# EAGLE design holo clock 1 l293 rotate 90 (EAGLE 6.2)
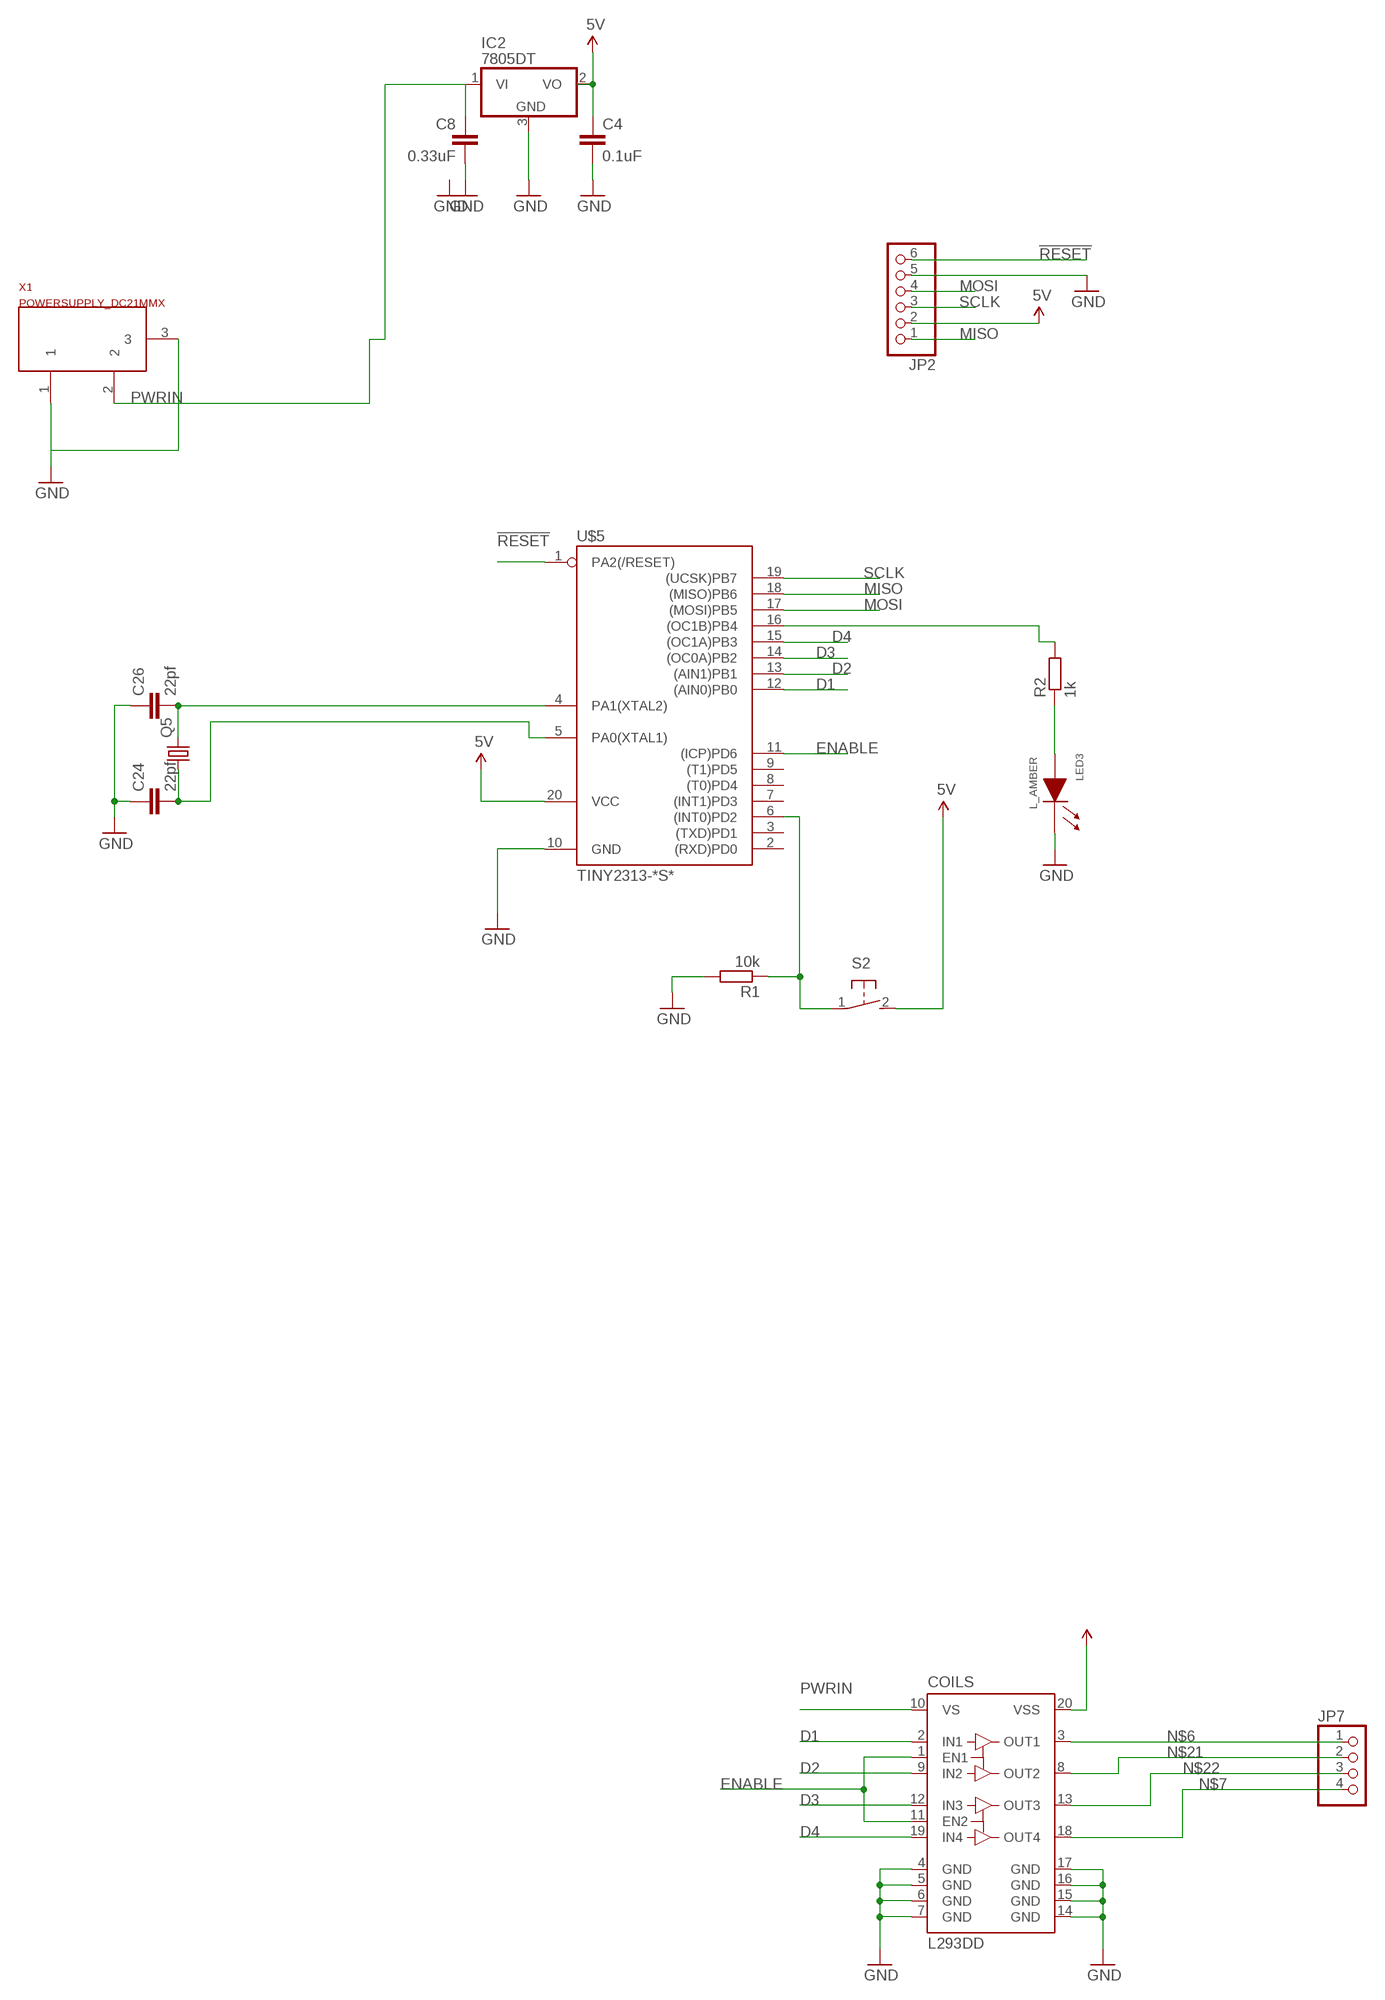
[diagram p0: schematic, sheet 1]

## Parts
C4  0.1uF  CAPPTH2  [CAP-PTH-SMALL2]
C8  0.33uF  CAPPTH2  [CAP-PTH-SMALL2]
C24  22pf  CAP0805  [0805]
C26  22pf  CAP0805  [0805]
COILS  L293DD  [SO20]
IC2  7805DT  [TO252]
JP2  PINHD-1X6  [1X06]
JP7  PINHD-1X04_2.54  [1X04]
LED3  L_AMBER  LED0805  [LED0805]
Q5  CRYSTALHC49S  [HC49/S]
R1  10k  R-EU_R0805  [R0805]
R2  1k  R-EU_R0805  [R0805]
S2  31-XX  [B3F-31XX]
U$5  TINY2313-*S*  [SO20L$]
X1  POWERSUPPLY_DC21MMX  [POWERSUPPLY_DC-21MM]

## Nets
5V: C4.1 COILS.20(VSS) IC2.2(VO) JP2.2 S2.2(S) U$5.20(VCC)
!RESET: JP2.6 U$5.1(PA2(/RESET))
D1: COILS.2(IN1) U$5.12((AIN0)PB0)
D2: COILS.9(IN2) U$5.13((AIN1)PB1)
D3: COILS.12(IN3) U$5.14((OC0A)PB2)
D4: COILS.19(IN4) U$5.15((OC1A)PB3)
ENABLE: COILS.1(EN1) COILS.11(EN2) U$5.11((ICP)PD6)
GND: C4.2 C8.2 C24.1 C26.1 COILS.4(GND) COILS.5(GND) COILS.6(GND) COILS.7(GND) COILS.14(GND) COILS.15(GND) COILS.16(GND) COILS.17(GND) IC2.3(GND) JP2.5 LED3.1(CA) R1.2 U$5.10(GND) X1.1 X1.3
MISO: JP2.1 U$5.18((MISO)PB6)
MOSI: JP2.4 U$5.17((MOSI)PB5)
N$2: R2.2 U$5.16((OC1B)PB4)
N$6 [power 2]: COILS.3(OUT1) JP7.1
N$7 [power 2]: COILS.18(OUT4) JP7.4 LED3.2(AN) R2.1
N$8: R1.1 S2.1(P) U$5.6((INT0)PD2)
N$21 [power 2]: COILS.8(OUT2) JP7.2
N$22 [power 2]: COILS.13(OUT3) JP7.3
N$80: C26.2 Q5.2 U$5.4(PA1(XTAL2))
N$81: C24.2 Q5.1 U$5.5(PA0(XTAL1))
PWRIN [power]: C8.1 COILS.10(VS) IC2.1(VI) X1.2
SCLK: JP2.3 U$5.19((UCSK)PB7)
Unconnected: U$5.2((RXD)PD0) U$5.3((TXD)PD1) U$5.7((INT1)PD3) U$5.8((T0)PD4) U$5.9((T1)PD5)

## Library data of the parts
C4 C8 C24 C26 = SparkFun:CAP: Capacitor Standard 0603 ceramic capacitor, and 0.1" leaded capacitor.
COILS = st-microelectronics:L293DD: PUSH-PULL FOUR CHANNEL DRIVER WITH DIODES Source: http://www.st.com/stonline/books/pdf/docs/1330.pdf; OC_FARNELL: unknown
IC2 = linear:78*: Positive VOLTAGE REGULATOR Source: http://cache.national.com/ds/LM/LM78L05.pdf http://www.fairchildsemi.com/ds/LM/LM7805.pdf
JP2 = pinhead:PINHD-1X6: PIN HEADER
JP7 = pinhead-2:PINHD-1X04: PIN HEADER
LED3 = MySMD:LED0805
Q5 = crystal:CRYSTAL: CRYSTAL; OC_FARNELL: 1667008; OC_NEWARK: unknown
R1 R2 = resistor:R-EU_: RESISTOR, European symbol
S2 = switch-omron:31-XX: OMRON SWITCH; MPN: B3F-3100; OC_FARNELL: 959704; OC_NEWARK: 36M3582
U$5 = avr-7:TINY2313*: Atmel Tiny2313 2K Flash, 128 bytes EEPROM, 128 bytes RAM
X1 = SmartPrj:POWERSUPPLY_DC21MM

## Net classes
1 power: width 1.27 mm, drill 1.016 mm
2 power 2: width 1.016 mm, drill 0.762 mm

## Board
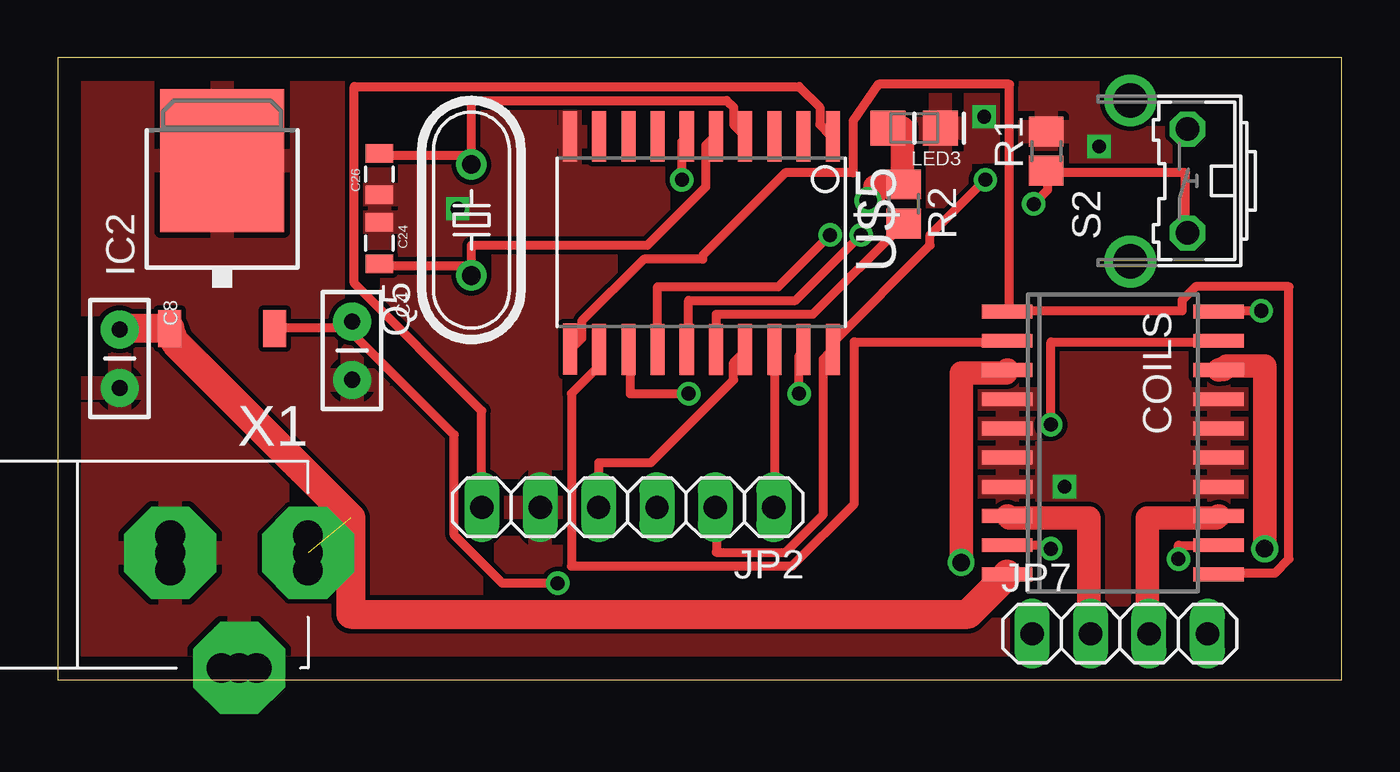
[diagram p1: board, top side]
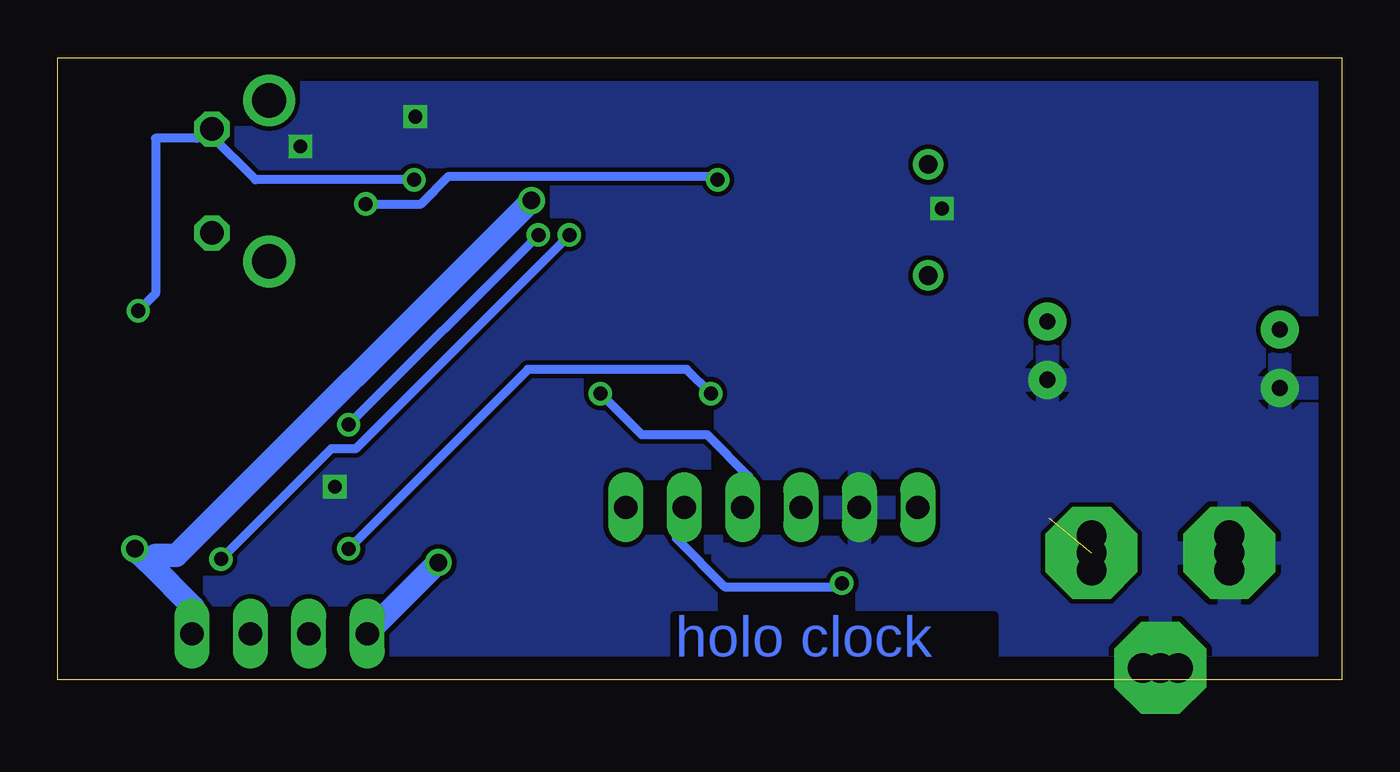
[diagram p2: board, bottom side, seen from below]

Size 55.86 x 27.07 mm. Coordinates in mm from the lower left corner, seen from the top.
Outline: 0,0 55.86,0 55.86,27.07 0,27.07 0,0
Copper layers (1*16): Top 0.035mm / dielectric 1.5mm / Bottom 0.035mm
Design rules: minimum track width 15mil, minimum drill 24mil, track to track 8mil, track to pad 8mil, pad to pad 8mil, via to via 8mil, smd to smd 8mil, copper to edge 40mil, drill to drill 8mil, minimum pad ring 10mil, minimum via ring 8mil, stop-mask expansion 4mil, vias tented up to drill 0mil, thermal gap 10mil

### Footprints (pad centres in the part's own frame; a part is rotated, then mirrored left to right if it is on the bottom)
CAP-PTH-SMALL2 = drill 0.7 pad 1.651: 1 0,0; 2 2.54,0
0805 = smd 0.8 x 1.2: 1 -0.9,0; 2 0.9,0
SO20 = smd 0.6 x 2.2: 1 -5.715,-4.6; 2 -4.445,-4.6; 3 -3.175,-4.6; 4 -1.905,-4.6; 5 -0.635,-4.6; 6 0.635,-4.6; 7 1.905,-4.6; 8 3.175,-4.6; 9 4.445,-4.6; 10 5.715,-4.6; 11 5.715,4.6; 12 4.445,4.6; 13 3.175,4.6; 14 1.905,4.6; 15 0.635,4.6; 16 -0.635,4.6; 17 -1.905,4.6; 18 -3.175,4.6; 19 -4.445,4.6; 20 -5.715,4.6
TO252 = smd 1 x 1.6: 1 -2.28,-4.8; 2 2.28,-4.8 | smd 5.4 x 6.2: 3 0,2.5
1X06 = drill 1.016 long: 1 -6.35,0; 2 -3.81,0; 3 -1.27,0; 4 1.27,0; 5 3.81,0; 6 6.35,0
1X04 = drill 1.016 long: 1 -3.81,0; 2 -1.27,0; 3 1.27,0; 4 3.81,0
LED0805 = smd 1.524 x 1.524: 1 0,0; 2 2.286,0
HC49/S = drill 0.813: 1 -2.413,0; 2 2.413,0
R0805 = smd 1.3 x 1.5: 1 -0.85,0; 2 0.85,0
B3F-31XX = drill 1.016 octagon: 1 -2.261,-1.245; 2 2.261,-1.245 | drill 1.499 pad 2.159: 3 -3.505,1.245; 4 3.505,1.245
SO20L$ = smd 0.61 x 2.21: 1 -5.715,-4.636; 2 -4.445,-4.636; 3 -3.175,-4.636; 4 -1.905,-4.636; 5 -0.635,-4.636; 6 0.635,-4.636; 7 1.905,-4.636; 8 3.175,-4.636; 9 4.445,-4.636; 10 5.715,-4.636; 11 5.715,4.61; 12 4.445,4.636; 13 3.175,4.636; 14 1.905,4.636; 15 0.635,4.636; 16 -0.635,4.636; 17 -1.905,4.636; 18 -3.175,4.636; 19 -4.445,4.636; 20 -5.715,4.636
POWERSUPPLY_DC-21MM = drill 1.3 pad 4 octagon: 1 -5.08,-3.353; 2 -0.076,-6.35; 3 -0.076,-0.356 | drill 1.3: 4 -5.08,-4.115; 5 -5.08,-2.591; 6 -0.838,-0.356; 7 0.686,-0.356; 8 -0.838,-6.35; 9 0.686,-6.35

### Placement (x,y rotation side)
C4  12.81,15.59 270 top
C8  2.7,15.24 270 top
C24  14,19 270 top
C26  14,22 90 top
COILS  45.9,10.3 270 top
IC2  7.16,20.08 0 top
JP2  24.8,7.5 180 top
JP7  46.2,2 0 top
LED3  38.4,24 180 top
Q5  18,20 90 top
R1  43,23 90 top
R2  36.8,20.7 270 top
S2  47.9,21.7 90 top
U$5  28,19 180 top
X1  4.54,5.59 90 top

### Tracks (layer width: path | path; a pad name or v marks a point on that pad's centre or on a via)
5V  (via drill 0.61)
  Top 0.381: v52.35,16.05 50.55,16.05 COILS.20 | IC2.2 9.45,15.3 12.75,15.3 12.75,15.45 C4.1 12.75,15.15 17.25,10.65 17.25,6.3 19.35,4.2 v21.75,4.2 | JP2.2 28.65,7.5 28.65,5.55 31.65,5.55 33.3,7.2 33.3,13.95 33.6,14.25 U$5.20 33.75,14.55 33.75,14.7 37.95,18.9 37.95,19.35 v40.35,21.75
  Bottom 0.381: v52.35,16.05 51.6,16.8 51.6,23.55 49.8,23.55 49.5,23.85 49.2,23.85 S2.2 49.2,23.7 47.25,21.75 v40.35,21.75 | v21.75,4.2 21.9,4.05 26.85,4.05 28.95,6.15 28.95,7.5 JP2.2
!RESET
  Top 0.381: JP2.6 18.45,11.7 12.9,17.25 12.9,25.8 32.25,25.8 33.15,24.9 33.15,24.15 33.6,23.7 U$5.1
D1
  Top 0.381: COILS.2 41.25,14.7 34.65,14.7 34.65,7.65 31.95,4.95 22.35,4.95 22.35,12.45 23.55,13.65 23.55,14.25 U$5.12
D2  (via drill 0.61)
  Top 0.381: v43.2,5.7 43.2,5.85 41.4,5.85 COILS.9 | v27.45,12.45 24.9,12.45 24.9,14.25 U$5.13
  Bottom 0.381: v43.2,5.7 35.4,13.5 28.5,13.5 v27.45,12.45
D3  (via drill 0.61)
  Top 0.381: v48.75,5.25 48.75,5.85 50.4,5.85 COILS.12 | v33.6,19.35 31.35,17.1 26.1,17.1 26.1,14.4 U$5.14
  Bottom 0.381: v48.75,5.25 43.95,10.05 42.9,10.05 v33.6,19.35
D4  (via drill 0.61)
  Top 0.381: v43.2,11.1 43.2,14.7 50.4,14.7 COILS.19 | v34.95,19.35 32.1,16.5 27.45,16.5 27.45,14.4 U$5.15
  Bottom 0.381: v34.95,19.35 v43.2,11.1
ENABLE
  Top 0.381: COILS.11 50.55,4.65 52.95,4.65 53.55,5.25 53.55,17.1 49.5,17.1 48.9,16.5 48.9,16.05 41.4,16.05 COILS.1 41.4,16.2 41.4,25.9 35.7,25.9 34.6,24.3 34.6,22.05 31.65,22.05 28.05,18.45 28.05,18.3 25.5,18.3 22.8,15.6 22.8,14.85 22.35,14.4 U$5.11
GND  (via drill 0.6)
  other vias: 43.8,8.4 45.3,23.2 40.3,24.5 17.4,20.5
  pour Bottom: 0,26 56,26 56,0 0,0
  pour Top: 0,26 56,26 56,0 0,0
MISO
  Top 0.381: U$5.18 31.2,14.25 31.2,7.5 JP2.1
MOSI
  Top 0.381: U$5.17 29.85,14.25 29.4,13.8 29.4,13.05 25.8,9.45 23.55,9.45 23.55,7.5 JP2.4
N$2
  Top 0.381: R2.2 32.85,15.9 28.65,15.9 28.65,14.4 U$5.16
N$6  (via drill 0.76)
  Top 1.016: v39.3,5.1 39.3,13.35 41.25,13.35 COILS.3
  Bottom 1.016: v39.3,5.1 42.3,2.1 JP7.1
N$7  (via drill 0.76)
  Top 1.016: LED3.2 36.75,24 36.75,21.6 R2.1 36.3,21.45 35.55,21.45 35.55,21.15 v35.25,20.85 | v52.5,5.7 52.5,13.65 50.85,13.65 50.7,13.5 50.55,13.5 COILS.18
  Bottom 1.016: 51.9,5.1 49.95,3.15 49.95,2.1 JP7.4 | 51.9,5.1 v52.5,5.7 | v35.25,20.85 50.7,5.4 51.6,5.4 51.9,5.1
N$8  (via drill 0.61)
  Top 0.381: S2.1 49.05,19.5 49.05,22.05 43.05,22.05 R1.1 43.05,21.9 43.05,21.3 v42.45,20.7 | v27.15,21.75 27.15,23.4 27.3,23.55 U$5.6
  Bottom 0.381: v27.15,21.75 27.3,21.9 38.85,21.9 40.05,20.7 v42.45,20.7
N$21
  Top 1.016: COILS.8 41.4,7.05 44.85,7.05 44.85,2.1 JP7.2
N$22
  Top 1.016: COILS.13 50.4,7.05 47.4,7.05 47.4,2.1 JP7.3
N$80
  Top 0.381: C26.2 14.1,22.8 18,22.8 Q5.2 18,25.2 29.1,25.2 29.4,24.9 29.4,24.15 29.85,23.7 U$5.4
N$81
  Top 0.381: C24.2 14.1,18 18,18 Q5.1 18,18.9 25.65,18.9 28.2,21.45 28.2,23.25 28.5,23.55 U$5.5
PWRIN  (1 unrouted)
  Top 1.27: C8.1 2.7,15.3 4.8,15.3 IC2.1 5.1,14.7 12.75,7.05 12.75,2.85 39.6,2.85 41.25,4.5 COILS.10
SCLK  (via drill 0.61)
  Top 0.381: v32.25,12.45 32.25,14.1 32.4,14.25 U$5.19
  Bottom 0.381: v32.25,12.45 30.45,10.65 27.6,10.65 25.8,8.85 25.8,7.5 JP2.3

### Text on the board
Bottom: holo clock